# EAGLE design VNT Controller Schematic (EAGLE 6.5.0)
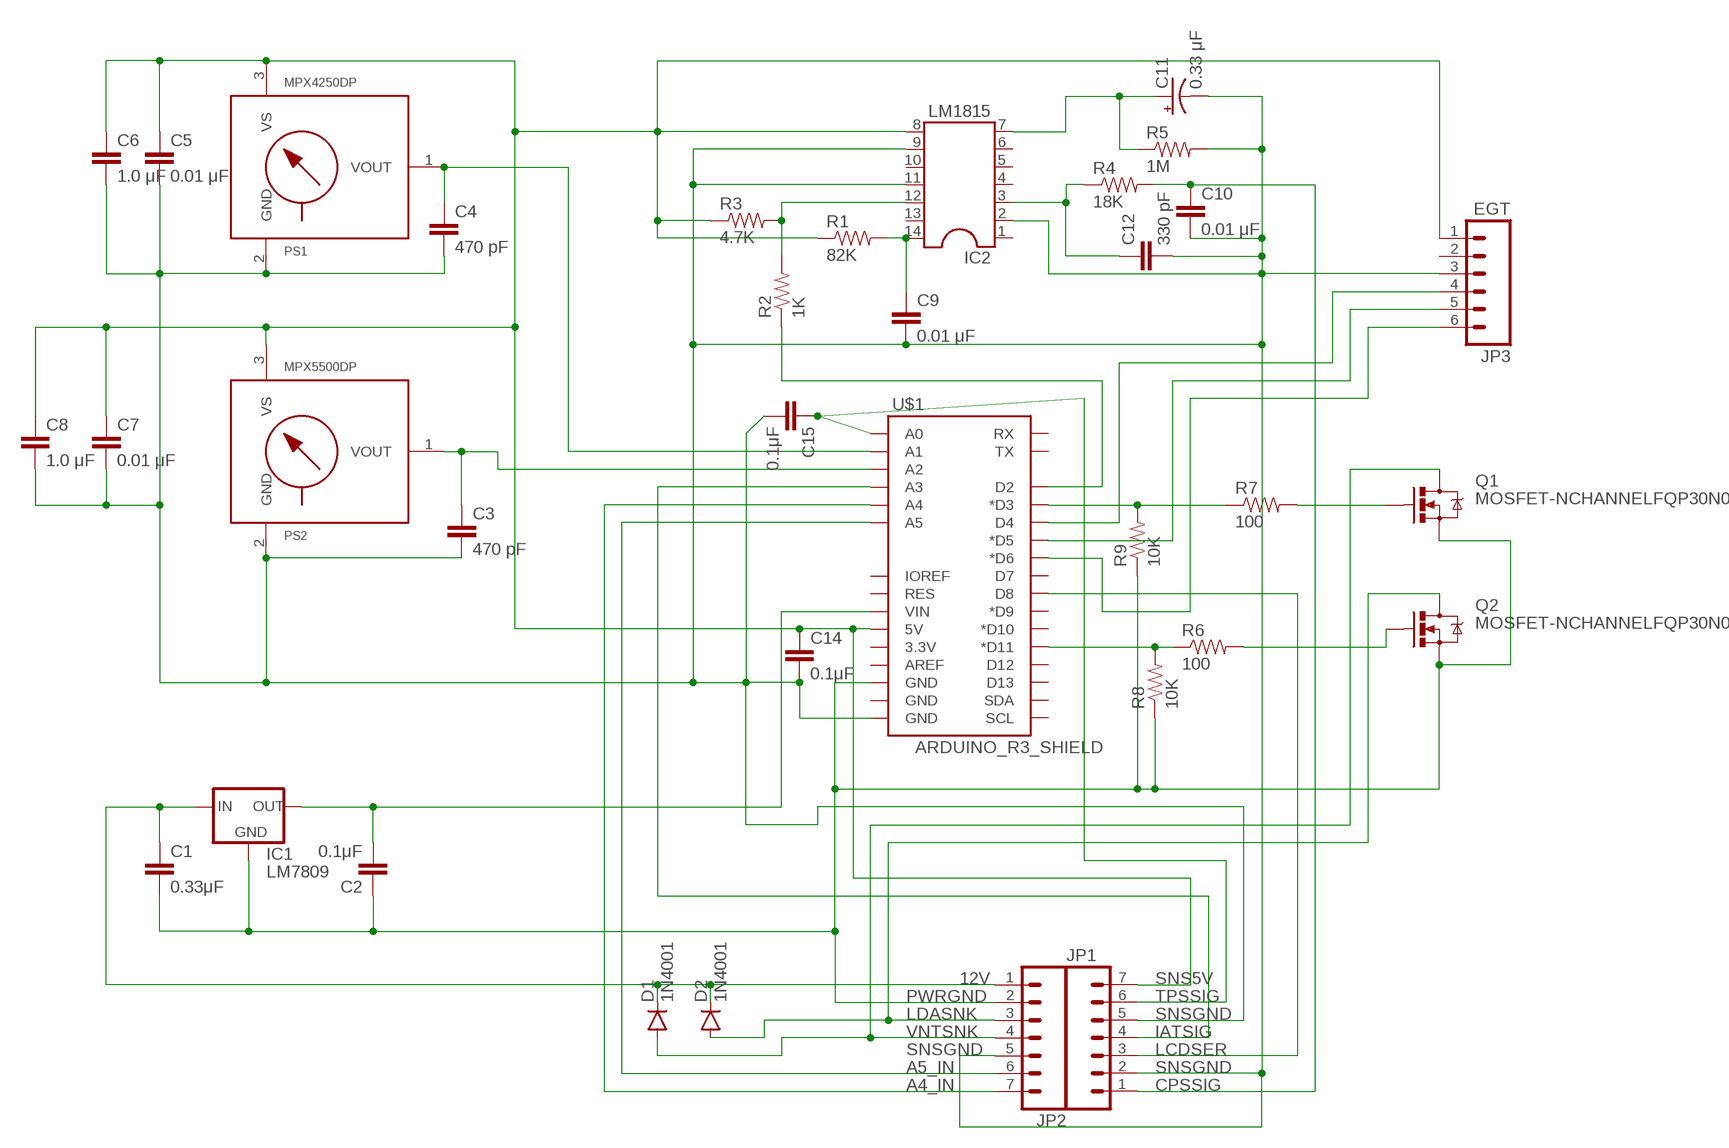
[diagram p0: schematic, sheet 1]

## Parts
C1  0.33μF  CAPPTH  [CAP-PTH-SMALL]
C2  0.1μF  CAPPTH  [CAP-PTH-SMALL]
C3  470 pF  CAPPTH  [CAP-PTH-SMALL]
C4  470 pF  CAPPTH  [CAP-PTH-SMALL]
C5  0.01 μF  CAPPTH  [CAP-PTH-SMALL]
C6  1.0 μF  CAPPTH  [CAP-PTH-SMALL]
C7  0.01 μF  CAPPTH  [CAP-PTH-SMALL]
C8  1.0 μF  CAPPTH  [CAP-PTH-SMALL]
C9  0.01 μF  CAPPTH  [CAP-PTH-SMALL]
C10  0.01 μF  CAPPTH  [CAP-PTH-SMALL]
C11  0.33 μF  CAP_POLPTH2  [CPOL-RADIAL-10UF-25V]
C12  330 pF  CAPPTH  [CAP-PTH-SMALL]
C14  0.1μF  CAPPTH  [CAP-PTH-SMALL]
C15  0.1μF  CAPPTH  [CAP-PTH-SMALL]
D1  1N4001  DIODEPTH  [DIODE-1N4001]
D2  1N4001  DIODEPTH  [DIODE-1N4001]
IC1  LM7809  V_REG_78XXSINK  [TO220-IGO]
IC2  LM1815  DIL14S  [SOCKET-14]
JP1  M07LOCK_LONGPADS  [1X07_LOCK_LONGPADS]
JP2  M07LOCK_LONGPADS  [1X07_LOCK_LONGPADS]
JP3  EGT  M06SIP_LOCK  [1X06-SIP_LOCK]
PS1  MPX4250DP  MPX-867C-H  [867C-H]
PS2  MPX5500DP  MPX-867C-H  [867C-H]
Q1  MOSFET-NCHANNELFQP30N06L  [TO220V]
Q2  MOSFET-NCHANNELFQP30N06L  [TO220V]
R1  82K  RESISTORPTH-1/4W-VERT  [AXIAL-0.1]
R2  1K  RESISTORPTH-1/4W-VERT  [AXIAL-0.1]
R3  4.7K  RESISTORPTH-1/4W-VERT  [AXIAL-0.1]
R4  18K  RESISTORPTH-1/4W-VERT  [AXIAL-0.1]
R5  1M  RESISTORPTH-1/4W-VERT  [AXIAL-0.1]
R6  100  RESISTORPTH-1/4W-VERT  [AXIAL-0.1]
R7  100  RESISTORPTH-1/4W-VERT  [AXIAL-0.1]
R8  10K  RESISTORPTH-1/4W-VERT  [AXIAL-0.1]
R9  10K  RESISTORPTH-1/4W-VERT  [AXIAL-0.1]
U$1  ARDUINO_R3_SHIELD  [UNO_R3_SHIELD]

## Nets
12V: C1.1 D1.C D2.C IC1.IN JP2.1
A4_IN: JP2.7 U$1.A4
A5_IN: JP2.6 U$1.A5
CPSSIG: C10.1 JP1.1 R4.P$2
IATSIG: JP1.4 U$1.A3
LCDSER: JP1.3 U$1.D8
LDASNK: D2.A JP2.3 Q2.2(D)
N$1: R6.P$1 R8.P$2 U$1.D11(*D11)
N$2: C3.1 PS2.1(VOUT) U$1.A2
N$3: Q2.1(G) R6.P$2
N$4: IC2.12 R2.P$2 R3.P$2
N$5: C4.1 PS1.1(VOUT) U$1.A1
N$6: R2.P$1 U$1.D2
N$7: C9.1 IC2.14 R1.P$2
N$8: R7.P$1 R9.P$2 U$1.D3(*D3)
N$9: C2.2 IC1.OUT U$1.VIN
N$10: Q1.1(G) R7.P$2
N$11: C11.1(+) IC2.7 R5.P$1
N$12: JP3.4 U$1.D4
N$13: JP3.5 U$1.D5(*D5)
N$14: C12.1 IC2.3 R4.P$1
N$15: JP3.6 U$1.D6(*D6)
PWRGND: C1.2 C2.1 IC1.GND JP2.2 Q1.3(S) Q2.3(S) R8.P$1 R9.P$1 U$1.GND@2(GND)
SNS5V: C5.1 C6.1 C7.1 C8.1 C14.1 IC2.8 JP1.7 JP3.1 PS1.3(VS) PS2.3(VS) R1.P$1 R3.P$1 U$1.5V
SNSGND: C3.2 C4.2 C5.2 C6.2 C7.2 C8.2 C9.2 C10.2 C11.2(-) C12.2 C14.2 C15.2 IC2.2 IC2.9 IC2.11 JP1.2 JP1.5 JP2.5 JP3.3 PS1.2(GND) PS2.2(GND) R5.P$2 U$1.GND@0(GND)
TPSSIG: C15.1 JP1.6 U$1.A0
VNTSNK: D1.A JP2.4 Q1.2(D)
Unconnected: IC2.1 IC2.4 IC2.5 IC2.6 IC2.10 IC2.13 JP3.2 PS1.4(NC) PS1.5(NC) PS1.6(NC) PS2.4(NC) PS2.5(NC) PS2.6(NC) U$1.3.3V U$1.AREF U$1.D7 U$1.D9(*D9) U$1.D10(*D10) U$1.D12 U$1.D13 U$1.GND@1(GND) U$1.IOREF U$1.RES U$1.RX U$1.SCL U$1.SDA U$1.TX

## Library data of the parts
C1-C10 C12 C14 C15 = SparkFun-Capacitors:CAP: Capacitor Standard 0603 ceramic capacitor, and 0.1" leaded capacitor.
C11 = SparkFun-Capacitors:CAP_POL: Capacitor Polarized These are standard SMD and PTH capacitors. Normally 10uF, 47uF, and 100uF in electrolytic and tantalum varieties. Always verify the external diameter of the through hole cap, it varies with capacity, voltage, and manufacturer. The EIA devices should be standard.
D1 D2 = SparkFun-DiscreteSemi:DIODE: Diode These are standard reverse protection diodes and small signal diodes. SMA package can handle up to about 1A. SOD-323 can handle about 200mA. What the SOD-323 package when ordering, there are some mfgs out there that are 5-pin packages.
IC1 = SparkFun-PowerIC:V_REG_78XX: Voltage Regulator Standard 7805 5V regulator. IGO (Input Ground Output). Spark Fun Electronics SKU : COM-00107
IC2 = ic-package:DIL14: Dual In Line / Socket
JP1 JP2 = SparkFun-Connectors:M07: Header 7 Standard 7-pin 0.1" header. Use with straight break away headers (SKU : PRT-00116), right angle break away headers (PRT-00553), swiss pins (PRT-00743), machine pins (PRT-00117), and female headers (PRT-00115). NOTES ON THE VARIANTS LOCK and LOCK_LONGPADS... This footprint was designed to help hold the alignment of a through-hole component (i.e. 7-pin header) while soldering it into place. You may notice that each hole has been shifted either up or down by 0.005 of an inch from it's more standard position (which is usually a perfectly straight line). This slight alteration caused the pins (the squares in the middle) to touch the edges of the holes. Because they are alternating, it causes a "brace" to hold the header in place. 0.005 has proven to be the perfect amount of "off-center" position when using our standard breakaway headers. Although looks a little odd when you look at the bare footprint, once you have a header in there, the alteration is very hard to notice. Also, if you push a header all the way into place, it is covered up entirely on the bottom side. This idea of altering the position of holes to aid alignment will be further integrated into the Sparkfun Library for other footprints. It can help hold any component with 3 or more connection pins.
JP3 = SparkFun-Connectors:M06: Header 6 Standard 6-pin 0.1" header. Use with straight break away headers (SKU : PRT-00116), right angle break away headers (PRT-00553), swiss pins (PRT-00743), machine pins (PRT-00117), and female headers (PRT-00115). Molex polarized connector foot print use with SKU : PRT-08094 with associated crimp pins and housings. NOTES ON THE VARIANTS LOCK and LOCK_LONGPADS... This footprint was designed to help hold the alignment of a through-hole component (i.e. 6-pin header) while soldering it into place. You may notice that each hole has been shifted either up or down by 0.005 of an inch from it's more standard position (which is a perfectly straight line). This slight alteration caused the pins (the squares in the middle) to touch the edges of the holes. Because they are alternating, it causes a "brace" to hold the component in place. 0.005 has proven to be the perfect amount of "off-center" position when using our standard breakaway headers. Although looks a little odd when you look at the bare footprint, once you have a header in there, the alteration is very hard to notice. Also,if you push a header all the way into place, it is covered up entirely on the bottom side. This idea of altering the position of holes to aid alignment will be further integrated into the Sparkfun Library for other footprints. It can help hold any component with 3 or more connection pins.
PS1 PS2 = mpx-freescale:MPX*****: Generic MPX pressure sensor
Q1 Q2 = SparkFun-DiscreteSemi:MOSFET-NCHANNEL: Common NMOSFET Parts MFG P/N Store ID Prod ID FDD8780 TRANS-09984 SI7820DN TRANS-11055 FDS6630A IC-08089 2N7002PW TRANS-11151 FQP30N06L COM-10213 TRANS-10060 BSS123LT1G TRANS-08345 BSS138 TRANS-00830 BS170 2N7000; PROD_ID: TRANS-10060
R1-R9 = SparkFun-Resistors:RESISTOR: Resistor Basic schematic elements and footprints for 0603, 1206, and PTH resistors.
U$1 = SparkFun-Boards:ARDUINO_R3_SHIELD: Shield form compatible with the Arduino Uno R3.

## Board
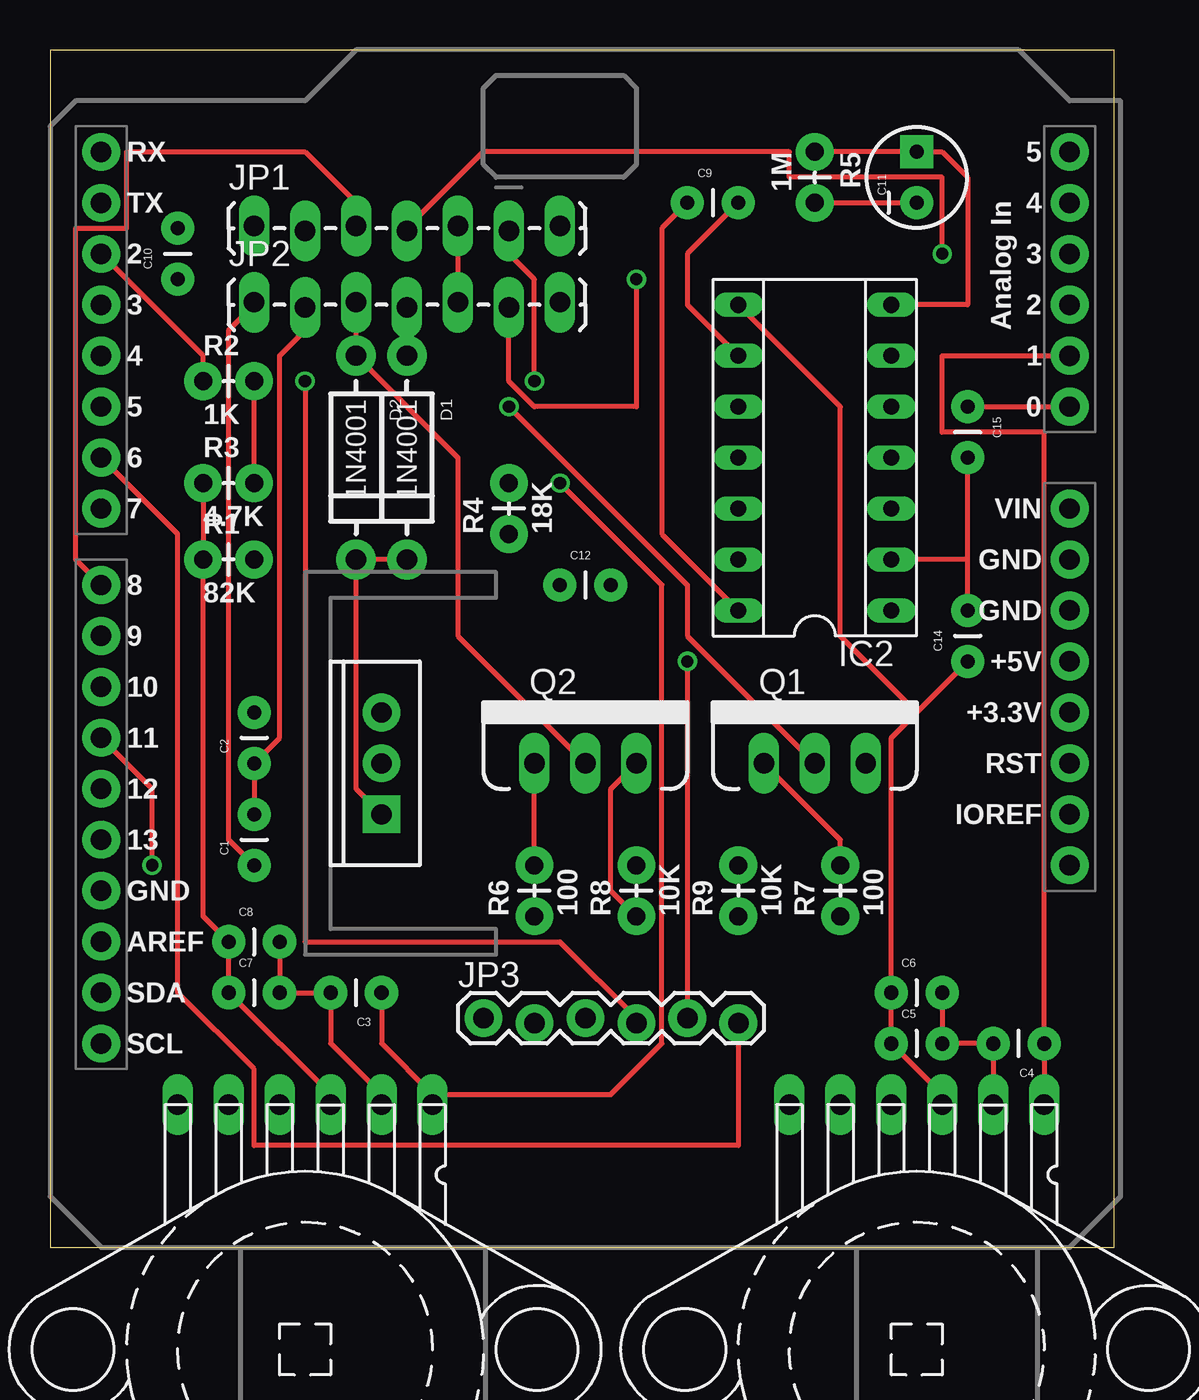
[diagram p1: board, top side]
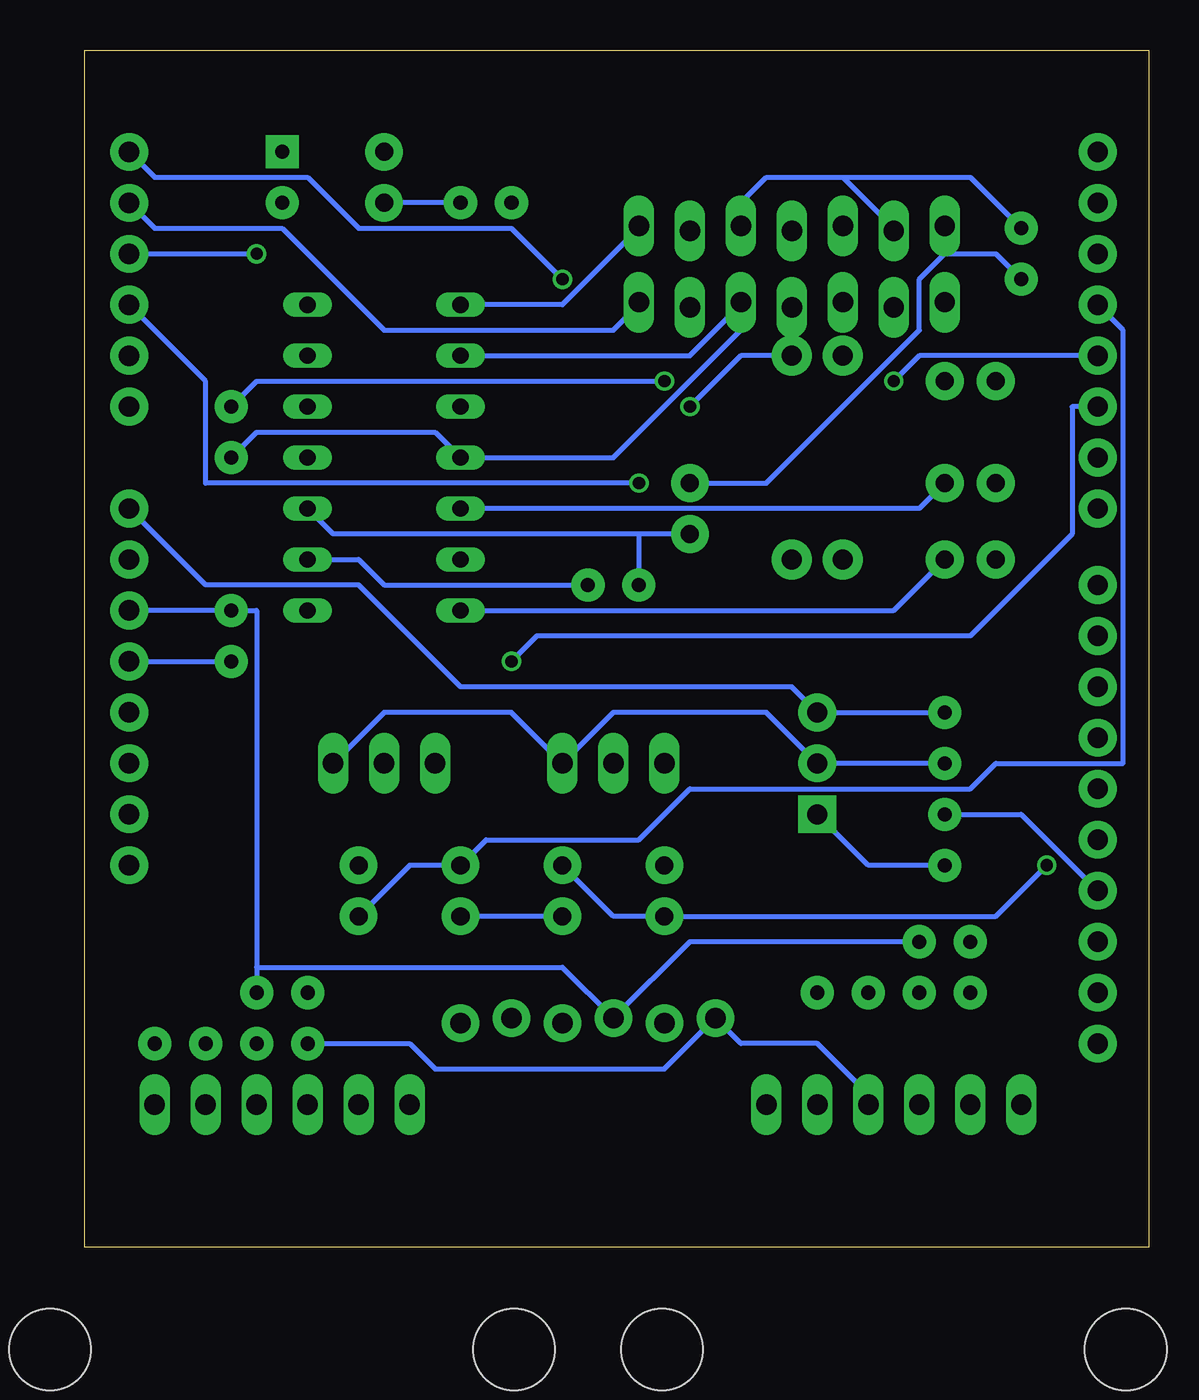
[diagram p2: board, bottom side, seen from below]

Size 53.01 x 59.68 mm. Coordinates in mm from the lower left corner, seen from the top.
Outline: 0,0 53.01,0 53.01,59.68 0,59.68 0,0
Copper layers (1*16): Top 0.0356mm / dielectric 1.5011mm / Bottom 0.0356mm
Design rules "LaenPCBOrder": minimum track width 6mil, minimum drill 13mil, track to track 6mil, track to pad 6mil, pad to pad 6mil, via to via 6mil, smd to smd 6mil, copper to edge 15mil, drill to drill 6mil, minimum pad ring 7mil, minimum via ring 7mil, stop-mask expansion 4mil, vias tented up to drill 0mil, thermal gap 10mil

### Footprints (pad centres in the part's own frame; a part is rotated, then mirrored left to right if it is on the bottom)
CAP-PTH-SMALL = drill 0.7 pad 1.651: 1 0,0; 2 2.54,0
CPOL-RADIAL-10UF-25V = drill 0.7 pad 1.651 square: 1 1.27,0 | drill 0.7 pad 1.651: 2 -1.27,0
DIODE-1N4001 = drill 1 pad 1.981: A -5.08,0; C 5.08,0
TO220-IGO = drill 1 pad 1.88: GND 0,0; OUT 2.54,0 | drill 1 pad 1.88 square: IN -2.54,0
SOCKET-14 = drill 0.813 long: 1 -7.62,-3.81; 2 -5.08,-3.81; 3 -2.54,-3.81; 4 0,-3.81; 5 2.54,-3.81; 6 5.08,-3.81; 7 7.62,-3.81; 8 7.62,3.81; 9 5.08,3.81; 10 2.54,3.81; 11 0,3.81; 12 -2.54,3.81; 13 -5.08,3.81; 14 -7.62,3.81
1X07_LOCK_LONGPADS = drill 1.016 long: 1 0,0.127; 2 2.54,-0.127; 3 5.08,0.127; 4 7.62,-0.127; 5 10.16,0.127; 6 12.7,-0.127; 7 15.24,0.127
1X06-SIP_LOCK = drill 1.016 pad 1.88: 1 0,0; 2 2.54,-0.254; 3 5.08,0; 4 7.62,-0.254; 5 10.16,0; 6 12.7,-0.254
867C-H = drill 1.016 long: 1 -6.35,-12.192; 2 -3.81,-12.192; 3 -1.27,-12.192; 4 1.27,-12.192; 5 3.81,-12.192; 6 6.35,-12.192 | hole 4.064: -11.557,0; 11.557,0
TO220V = drill 1.016 long: 1 -2.54,0; 2 0,0; 3 2.54,0
AXIAL-0.1 = drill 0.9 pad 1.88: P$1 0,0; P$2 2.54,0
UNO_R3_SHIELD = drill 1.016 pad 1.88: 3.3V 50.8,26.67; 5V 50.8,29.21; A0 50.8,41.91; A1 50.8,44.45; A2 50.8,46.99; A3 50.8,49.53; A4 50.8,52.07; A5 50.8,54.61; AREF 2.54,15.24; D2 2.54,49.53; D3 2.54,46.99; D4 2.54,44.45; D5 2.54,41.91; D6 2.54,39.37; D7 2.54,36.83; D8 2.54,33.02; D9 2.54,30.48; D10 2.54,27.94; D11 2.54,25.4; D12 2.54,22.86; D13 2.54,20.32; GND@0 50.8,31.75; GND@1 50.8,34.29; GND@2 2.54,17.78; IOREF 50.8,21.59; NC 50.8,19.05; RES 50.8,24.13; RX 2.54,54.61; SCL 2.54,10.16; SDA 2.54,12.7; TX 2.54,52.07; VIN 50.8,36.83

### Placement (x,y rotation side)
C1  10.16,19.05 90 top
C2  10.16,24.13 90 top
C3  16.51,12.7 180 top
C4  49.53,10.16 180 top
C5  41.91,10.16 0 top
C6  41.91,12.7 0 top
C7  8.89,12.7 0 top
C8  8.89,15.24 0 top
C9  31.75,52.07 0 top
C10  6.35,48.26 90 top
C11  43.18,53.34 90 top
C12  25.4,33.02 0 top
C14  45.72,29.21 90 top
C15  45.72,41.91 270 top
D1  17.78,39.37 270 top
D2  15.24,39.37 270 top
IC1  16.51,24.13 90 top
IC2  38.1,39.37 90 top
JP1  10.16,50.8 0 top
JP2  10.16,46.99 0 top
JP3  21.59,11.43 0 top
PS1  43.18,-5.08 180 top
PS2  12.7,-5.08 180 top
Q1  38.1,24.13 0 top
Q2  26.67,24.13 0 top
R1  7.62,34.29 0 top
R2  7.62,43.18 0 top
R3  7.62,38.1 0 top
R4  22.86,35.56 90 top
R5  38.1,54.61 270 top
R6  24.13,16.51 90 top
R7  39.37,16.51 90 top
R8  29.21,16.51 90 top
R9  34.29,16.51 90 top
U$1  0,0 0 top

### Tracks (layer width: path | path; a pad name or v marks a point on that pad's centre or on a via)
12V
  Top 0.254: D1.C D2.C 15.24,22.86 IC1.IN | C1.1 8.89,20.32 8.89,45.72 10.16,46.99 JP2.1
  Bottom 0.254: IC1.IN 13.97,19.05 C1.1
A4_IN
  Bottom 0.254: U$1.A4 49.53,50.8 43.18,50.8 38.1,45.72 26.67,45.72 25.4,46.99 JP2.7
A5_IN  (via drill 0.61)
  Top 0.254: JP2.6 22.86,43.18 24.13,41.91 29.21,41.91 v29.21,48.26
  Bottom 0.254: v29.21,48.26 31.75,50.8 39.37,50.8 41.91,53.34 49.53,53.34 U$1.A5
CPSSIG
  Bottom 0.254: 10.16,49.53 11.43,48.26 11.43,45.72 19.05,38.1 R4.P$2 | C10.1 7.62,49.53 10.16,49.53 | 10.16,49.53 JP1.1
IATSIG  (via drill 0.61)
  Top 0.254: v44.45,49.53 44.45,53.34 36.83,53.34 36.83,54.61 21.59,54.61 17.78,50.8 JP1.4
  Bottom 0.254: U$1.A3 v44.45,49.53
LCDSER
  Top 0.254: U$1.D8 1.27,34.29 1.27,50.8 3.81,50.8 3.81,54.61 12.7,54.61 15.24,52.07 JP1.3
LDASNK
  Top 0.254: JP2.3 D2.A 20.32,39.37 20.32,30.48 Q2.2
N$1  (via drill 0.61)
  Top 0.254: U$1.D11 5.08,22.86 v5.08,19.05
  Bottom 0.254: v5.08,19.05 7.62,16.51 R6.P$1 26.67,16.51 R8.P$2
N$2  (via drill 0.61)
  Top 0.254: 19.05,7.62 16.51,10.16 C3.1 | v25.4,38.1 30.48,33.02 30.48,10.16 27.94,7.62 19.05,7.62 | 19.05,7.62 PS2.1
  Bottom 0.254: U$1.A2 46.99,43.18 46.99,38.1 v25.4,38.1
N$3
  Top 0.254: R6.P$2 Q2.1
N$4
  Top 0.254: R3.P$2 R2.P$2
  Bottom 0.254: IC2.12 11.43,36.83 R3.P$2
N$5
  Top 0.254: PS1.1 C4.1 49.53,40.64 44.45,40.64 44.45,44.45 U$1.A1
N$6
  Top 0.254: U$1.D2 7.62,44.45 R2.P$1
N$7
  Top 0.254: IC2.14 30.48,35.56 30.48,50.8 C9.1
  Bottom 0.254: R1.P$2 12.7,31.75 IC2.14
N$8
  Bottom 0.254: U$1.D3 1.27,45.72 1.27,24.13 7.62,24.13 8.89,22.86 22.86,22.86 25.4,20.32 33.02,20.32 R9.P$2 36.83,19.05 R7.P$1
N$9
  Bottom 0.254: C2.2 IC1.OUT 17.78,27.94 34.29,27.94 39.37,33.02 46.99,33.02 U$1.VIN
N$10
  Top 0.254: Q1.1 39.37,20.32 R7.P$2
N$11
  Top 0.254: IC2.7 45.72,46.99 45.72,53.34 44.45,54.61 C11.1 R5.P$1
N$12  (via drill 0.61)
  Top 0.254: v12.7,43.18 12.7,15.24 25.4,15.24 29.21,11.43 JP3.4
  Bottom 0.254: v12.7,43.18 11.43,44.45 U$1.D4
N$13  (via drill 0.61)
  Top 0.254: v31.75,29.21 JP3.5
  Bottom 0.254: v31.75,29.21 30.48,30.48 8.89,30.48 3.81,35.56 3.81,41.91 U$1.D5
N$14
  Bottom 0.254: IC2.3 40.64,35.56 25.4,35.56 | R4.P$1 25.4,35.56 | 25.4,35.56 C12.1
N$15
  Top 0.254: U$1.D6 6.35,35.56 6.35,12.7 10.16,8.89 10.16,5.08 34.29,5.08 JP3.6 34.29,11.43
PWRGND
  Top 0.254: Q2.3 27.94,22.86 27.94,17.78 R8.P$1 | JP2.2 12.7,45.72 11.43,44.45 11.43,25.4 C2.1 C1.2
  Bottom 0.254: Q1.3 38.1,26.67 31.75,26.67 Q2.3 26.67,26.67 19.05,26.67 IC1.GND C2.1 | R8.P$1 R9.P$1 | U$1.GND@2 6.35,21.59 C1.2
SNS5V
  Top 0.254: R3.P$1 R1.P$1 7.62,16.51 C8.1 C7.1 13.97,7.62 PS2.3 | PS1.3 44.45,7.62 C5.1 C6.1 41.91,25.4 43.18,26.67 | 43.18,26.67 C14.1 | IC2.8 39.37,41.91 39.37,30.48 43.18,26.67
  Bottom 0.254: PS2.3 13.97,7.62 16.51,10.16 20.32,10.16 JP3.1 24.13,8.89 35.56,8.89 36.83,10.16 C5.1 | IC2.8 29.21,46.99 25.4,50.8 JP1.7 | U$1.5V C14.1
SNSGND
  Top 0.254: JP1.5 JP2.5 | R5.P$2 C11.2 | IC2.9 31.75,46.99 31.75,49.53 C9.2 | PS2.2 16.51,7.62 13.97,10.16 C3.2 C7.2 C8.2 | C6.2 C5.2 C4.2 PS1.2 | 45.72,34.29 IC2.2 | C14.2 45.72,34.29 | 45.72,34.29 C15.2
  Bottom 0.254: 15.24,53.34 12.7,50.8 JP1.2 | 15.24,53.34 19.05,53.34 20.32,52.07 JP1.5 | C9.2 R5.P$2 | 20.32,46.99 22.86,44.45 IC2.9 | C8.2 22.86,15.24 JP3.3 29.21,13.97 44.45,13.97 | C15.2 44.45,40.64 35.56,40.64 IC2.11 26.67,39.37 20.32,45.72 20.32,46.99 | C12.2 38.1,33.02 39.37,34.29 IC2.2 | U$1.GND@0 C14.2 44.45,31.75 44.45,13.97 | 44.45,13.97 C6.2 | 20.32,46.99 JP2.5 | C10.2 8.89,53.34 15.24,53.34
TPSSIG  (via drill 0.61)
  Top 0.254: v24.13,43.18 24.13,48.26 22.86,49.53 JP1.6 | C15.1 U$1.A0
  Bottom 0.254: v24.13,43.18 44.45,43.18 C15.1
VNTSNK  (via drill 0.61)
  Top 0.254: D1.A JP2.4 | Q1.2 31.75,30.48 31.75,33.02 v22.86,41.91
  Bottom 0.254: v22.86,41.91 20.32,44.45 D1.A